# Altium project MioMicro.PrjPcb
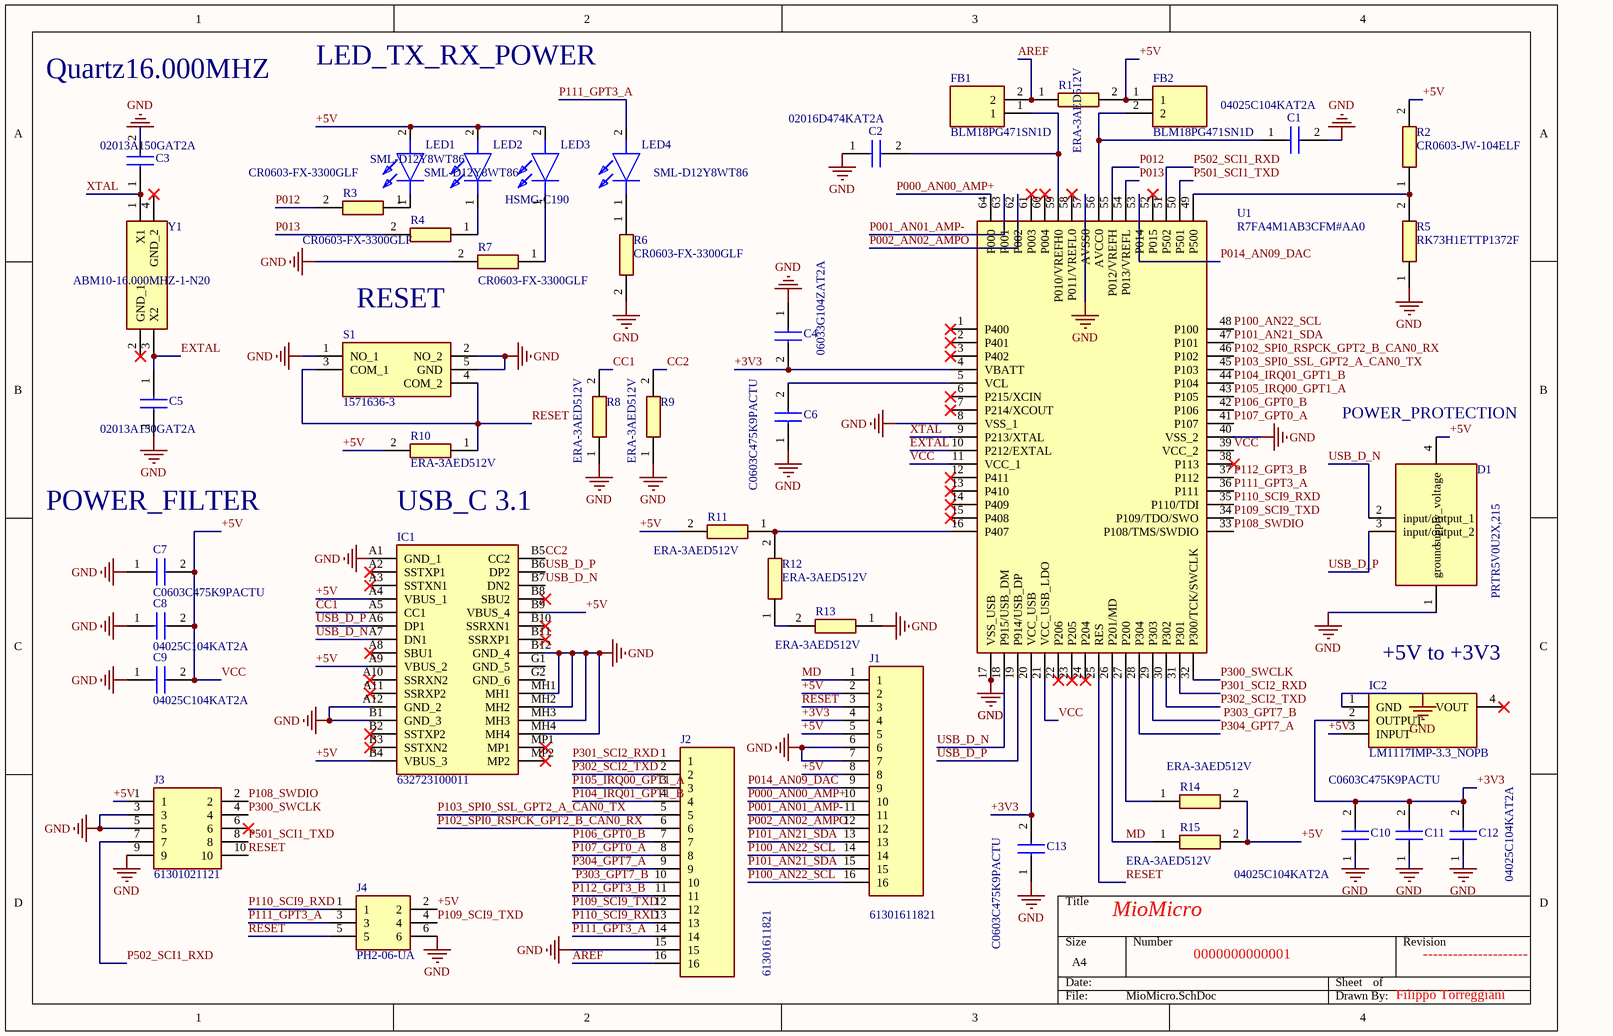
[diagram p0: MioMicro.SchDoc]
1 sheet, 44 parts. Net scope: global (net labels, ports and power ports of the same name join across sheets).
Board file: MioMicro.PcbDoc

## Sheet MioMicro.SchDoc
size A4; SheetNumber: 1; SheetTotal: 1

### Parts
C1  04025C104KAT2A  [CAPC1005X56N]
C2  02016D474KAT2A  [CAPC0603X33N]
C3  02013A150GAT2A  [CAPC0603X33N]
C4  06033G104ZAT2A  [CAPC1608X90N]
C5  02013A150GAT2A  [CAPC0603X33N]
C6  C0603C475K9PACTU  [C0603]
C7  C0603C475K9PACTU  [C0603]
C8  04025C104KAT2A  [CAPC1005X56N]
C9  04025C104KAT2A  [CAPC1005X56N]
C10  C0603C475K9PACTU  [C0603]
C11  04025C104KAT2A  [CAPC1005X56N]
C12  04025C104KAT2A  [CAPC1005X56N]
C13  C0603C475K9PACTU  [C0603]
D1  PRTR5V0U2X,215  [PRTR5V0U2X]
FB1  BLM18PG471SN1D  [BLM18SP221SN1B]
FB2  BLM18PG471SN1D  [BLM18SP221SN1B]
IC1  632723100011  [632723100011]
IC2  LM1117IMP-3.3_NOPB  [SOT230P700X180-4N]
J1  61301611821  [RHDR16W82P0X254_1X16_4114X250X865P]
J2  61301611821  [RHDR16W82P0X254_1X16_4114X250X865P]
J3  61301021121  [HDRV10W64P254X254_2X5_1270X508X869P]
J4  PH2-06-UA  [HDRV6W64P254_2X3_762X500X901P]
LED1  SML-D12Y8WT86  [LEDM1620X150N]
LED2  SML-D12Y8WT86  [LEDM1620X150N]
LED3  HSMG-C190  [LEDC1608X90N]
LED4  SML-D12Y8WT86  [LEDM1620X150N]
R1  ERA-3AED512V  [ERA3AEB101V]
R2  CR0603-JW-104ELF  [RESC1608X55N]
R3  CR0603-FX-3300GLF  [RESC1608X55N]
R4  CR0603-FX-3300GLF  [RESC1608X55N]
R5  RK73H1ETTP1372F  [RESC1005X40N]
R6  CR0603-FX-3300GLF  [RESC1608X55N]
R7  CR0603-FX-3300GLF  [RESC1608X55N]
R8  ERA-3AED512V  [ERA3AEB101V]
R9  ERA-3AED512V  [ERA3AEB101V]
R10  ERA-3AED512V  [ERA3AEB101V]
R11  ERA-3AED512V  [ERA3AEB101V]
R12  ERA-3AED512V  [ERA3AEB101V]
R13  ERA-3AED512V  [ERA3AEB101V]
R14  ERA-3AED512V  [ERA3AEB101V]
R15  ERA-3AED512V  [ERA3AEB101V]
S1  1571636-3  [15716363]
U1  R7FA4M1AB3CFM#AA0  [QFP50P1200X1200X170-64N]
Y1  ABM10-16.000MHZ-1-N20  [ABM10]

### Nets
GND: C1.2 C2.1 C3.2 C4.1 C5.2 C6.1 C7.1 C8.1 C9.1 C10.1 C11.1 C12.1 C13.1 D1.1(ground) IC1.A1(GND_1) IC1.A12(GND_2) IC1.B1(GND_3) IC1.B12(GND_4) IC1.MH1 IC1.MH2 IC1.MH3 IC1.MH4 IC2.1(GND) J1.6 J1.7 J2.15 J3.3 J3.5 J3.9 J4.6 R5.1 R6.2 R7.2 R8.1 R9.1 R13.1 S1.1(NO_1) S1.2(NO_2) S1.5(GND) U1.8(VSS_1) U1.17(VSS_USB) U1.40(VSS_2) U1.57(AVSS0)
 P303_GPT7_B: J2.10 U1.29(P303)
+3V3: C4.2 C10.2 C11.2 C12.2 C13.2 IC2.2(OUTPUT) J1.4 U1.4(VBATT) U1.20(VCC_USB)
+5V: C7.2 C8.2 C9.2 D1.4(supply_voltage) FB2.1 IC1.A4(VBUS_1) IC1.A9(VBUS_2) IC1.B4(VBUS_3) IC1.B9(VBUS_4) IC2.3(INPUT) J1.2 J1.5 J1.8 J3.1 J4.2 LED1.2(A) LED2.2(A) LED3.2(A) R1.2 R2.2 R10.2 R11.2 R14.2 R15.2 U1.11(VCC_1) U1.21(VCC_USB_LDO) U1.39(VCC_2)  [also labelled VCC]
AREF: FB1.2 J2.16 R1.1
CC1: IC1.A5(CC1) R8.2
CC2: IC1.B5(CC2) R9.2
EXTAL: C5.1 U1.10(P212/EXTAL) Y1.3(X2)
MD: J1.1 R15.1 U1.26(P201/MD)
P000_AN00_AMP+: J1.10 U1.64(P000)
P001_AN01_AMP-: J1.11 U1.63(P001)
P002_AN02_AMPO: J1.12 U1.62(P002)
P012: R3.2 U1.55(P012/VREFH)
P013: R4.2 U1.54(P013/VREFL)
P014_AN09_DAC: J1.9 U1.53(P014)
P100_AN22_SCL: J1.14 J1.16 U1.48(P100)
P101_AN21_SDA: J1.13 J1.15 U1.47(P101)
P102_SPI0_RSPCK_GPT2_B_CAN0_RX: J2.6 U1.46(P102)
P103_SPI0_SSL_GPT2_A_CAN0_TX: J2.5 U1.45(P103)
P104_IRQ01_GPT1_B: J2.4 U1.44(P104)
P105_IRQ00_GPT1_A: J2.3 U1.43(P105)
P106_GPT0_B: J2.7 U1.42(P106)
P107_GPT0_A: J2.8 U1.41(P107)
P108_SWDIO: J3.2 U1.33(P108/TMS/SWDIO)
P109_SCI9_TXD: J2.12 J4.4 U1.34(P109/TDO/SWO)
P110_SCI9_RXD: J2.13 J4.1 U1.35(P110/TDI)
P111_GPT3_A: J2.14 J4.3 LED4.2(A) U1.36(P111)
P112_GPT3_B: J2.11 U1.37(P112)
P300_SWCLK: J3.4 U1.32(P300/TCK/SWCLK)
P301_SCI2_RXD: J2.1 U1.31(P301)
P302_SCI2_TXD: J2.2 U1.30(P302)
P304_GPT7_A: J2.9 U1.28(P304)
P501_SCI1_TXD: J3.8 U1.50(P501)
P502_SCI1_RXD: J3.7 U1.51(P502)
RESET: J1.3 J3.10 J4.5 R10.1 S1.3(COM_1) S1.4(COM_2) U1.25(RES)
USB_D_N: D1.2(input/output_1) IC1.A7(DN1) IC1.B7(DN2) U1.18(P915/USB_DM)
USB_D_P: D1.3(input/output_2) IC1.A6(DP1) IC1.B6(DP2) U1.19(P914/USB_DP)
XTAL: C3.1 U1.9(P213/XTAL) Y1.1(X1)
NetC1_1: C1.1 FB2.2 U1.56(AVCC0)
NetC2_2: C2.2 FB1.1 U1.59(P010/VREFH0)
NetC6_2: C6.2 U1.5(VCL)
NetLED1_1: LED1.1(K) R3.1
NetLED2_1: LED2.1(K) R4.1
NetLED3_1: LED3.1(K) R7.1
NetLED4_1: LED4.1(K) R6.1
NetR2_1: R2.1 R5.2 U1.49(P500)
NetR11_1: R11.1 R12.2 U1.16(P407)
NetR12_1: R12.1 R13.2
NetR14_1: R14.1 U1.27(P200)

Not connected (* = marked no-connect by the designer): IC1 A2(SSTXP1)* A3(SSTXN1)* A8(SBU1)* A10(SSRXN2)* A11(SSRXP2)* B2(SSTXP2)* B3(SSTXN2)* B8(SBU2)* B10(SSRXN1)* B11(SSRXP1)* G1(GND_5) G2(GND_6) MP1* MP2*; IC2 4(VOUT)*; J3 6*; U1 1(P400)* 2(P401)* 3(P402)* 6(P215/XCIN)* 7(P214/XCOUT)* 12(P411)* 13(P410)* 14(P409)* 15(P408)* 22(P206)* 23(P205)* 24(P204)* 38(P113)* 52(P015)* 58(P011/VREFL0)* 60(P004)* 61(P003)*; Y1 2(GND_1)* 4(GND_2)*

### Notes on the sheet
- Quartz16.000MHZ
- LED_TX_RX_POWER
- RESET
- (near D1) POWER_PROTECTION
- POWER_FILTER
- USB_C 3.1
- +5V to +3V3
- MioMicro
- 0000000000001
- ---------------------
- Filippo Torreggiani

### Library data of the parts
C1 C8 C9 C11 C12 = 04025C104KAT2A: Capacitor; Manufacturer_Name: AVX; Datasheet Link: http://www.mouser.com/catalog/supplier/library/pdf/AVXSurfaceMountCeramic.pdf; Height: 0.56mm; Manufacturer_Part_Number: 04025C104KAT2A; Mouser Part Number: 581-04025C104KAT2A; Mouser Price/Stock: https://www.mouser.co.uk/ProductDetail/AVX/04025C104KAT2A?qs=ZBeOGGPQgEFYcwOskjAIVQ%3D%3D; Arrow Part Number: 04025C104KAT2A; Arrow Price/Stock: https://www.arrow.com/en/products/04025c104kat2a/avx?region=nac
C2 = 02016D474KAT2A: Capacitor; Manufacturer_Name: AVX; Datasheet Link: http://www.mouser.com/catalog/supplier/library/pdf/AVXSurfaceMountCeramic.pdf; Height: 0.33mm; Manufacturer_Part_Number: 02016D474KAT2A; Mouser Part Number: 581-02016D474KAT2A; Mouser Price/Stock: https://www.mouser.co.uk/ProductDetail/AVX/02016D474KAT2A?qs=a6Vv43ErYnwNI9YcsWUNpw%3D%3D
C3 C5 = 02013A150GAT2A: Capacitor; Manufacturer_Name: AVX; Datasheet Link: http://www.mouser.com/catalog/supplier/library/pdf/AVXSurfaceMountCeramic.pdf; Height: 0.33mm; Manufacturer_Part_Number: 02013A150GAT2A; Mouser Part Number: 581-02013A150GAT2A; Mouser Price/Stock: https://www.mouser.co.uk/ProductDetail/AVX/02013A150GAT2A/?qs=o212fjDx7AHn1RFYvVFd2g%3D%3D; Arrow Part Number: 02013A150GAT2A; Arrow Price/Stock: https://www.arrow.com/en/products/02013a150gat2a/avx
C4 = 06033G104ZAT2A: Capacitor; Manufacturer_Name: AVX; Datasheet Link: https://componentsearchengine.com/Datasheets/1/06031A100FAT2A.pdf; Height: 0.9mm; Manufacturer_Part_Number: 06033G104ZAT2A; Mouser Part Number: 581-06033G104Z; Mouser Price/Stock: https://www.mouser.co.uk/ProductDetail/AVX/06033G104ZAT2A?qs=NXubJDmysXJMPmHfVo6Z%252BA%3D%3D; Arrow Part Number: 06033G104ZAT2A; Arrow Price/Stock: https://www.arrow.com/en/products/06033g104zat2a/avx?region=nac
C6 C7 C10 C13 = C0603C475K9PACTU: Capacitor; Manufacturer_Name: KEMET; Datasheet Link: https://content.kemet.com/datasheets/KEM_C1006_X5R_SMD.pdf; Height: 0.87mm; Manufacturer_Part_Number: C0603C475K9PACTU; Mouser Part Number: 80-C0603C475K9P; Mouser Price/Stock: https://www.mouser.co.uk/ProductDetail/KEMET/C0603C475K9PACTU?qs=UdQET6xYxVBhr%252BaRHVEWxA%3D%3D; Arrow Part Number: C0603C475K9PACTU; Arrow Price/Stock: https://www.arrow.com/en/products/c0603c475k9pactu/kemet-corporation?region=nac
D1 = PRTR5V0U2X,215: Diode; Manufacturer_Name: Nexperia; Datasheet Link: https://assets.nexperia.com/documents/data-sheet/PRTR5V0U2X.pdf; Height: 1.1mm; Manufacturer_Part_Number: PRTR5V0U2X,215; Mouser Part Number: 771-PRTR5V0U2X-T/R; Mouser Price/Stock: https://www.mouser.co.uk/ProductDetail/Nexperia/PRTR5V0U2X215?qs=LOCUfHb8d9sDkgY4cRj8Lw%3D%3D; Arrow Part Number: PRTR5V0U2X,215; Arrow Price/Stock: https://www.arrow.com/en/products/prtr5v0u2x215/nexperia?region=europe
FB1 FB2 = BLM18PG471SN1D: Ferrite Bead; Manufacturer_Name: Murata Electronics; Datasheet Link: http://www.murata.com/~/media/webrenewal/support/library/catalog/products/emc/emifil/c31e.ashx?la=en-gb; Height: 0.95mm; Manufacturer_Part_Number: BLM18PG471SN1D; Mouser Part Number: 81-BLM18PG471SN1D; Mouser Price/Stock: https://www.mouser.co.uk/ProductDetail/Murata-Electronics/BLM18PG471SN1D?qs=EYzdjubb4S%2FN1Ip39GrHyg%3D%3D; Arrow Part Number: BLM18PG471SN1D; Arrow Price/Stock: https://www.arrow.com/en/products/blm18pg471sn1d/murata-manufacturing?region=nac
IC1 = 632723100011: Integrated Circuit; Manufacturer_Name: Wurth Elektronik; Datasheet Link: https://componentsearchengine.com/Datasheets/1/632723100011.pdf; Height: 3.11mm; Manufacturer_Part_Number: 632723100011; Mouser Part Number: 710-632723100011; Mouser Price/Stock: https://www.mouser.co.uk/ProductDetail/Wurth-Elektronik/632723100011?qs=NK6InXoXhq4o62C9ULXLjQ%3D%3D
IC2 = LM1117IMP-3.3_NOPB: Integrated Circuit; Manufacturer_Name: Texas Instruments; Manufacturer_Part_Number: LM1117IMP-3.3/NOPB; Datasheet Link: https://www.ti.com/lit/ds/symlink/lm1117.pdf?ts=1607578196475&ref_url=https%253A%252F%252Fwww.google.com%252F; Height: 1.8mm; Mouser Part Number: 926-LM1117IMP3.3NOPB; Mouser Price/Stock: https://www.mouser.co.uk/ProductDetail/Texas-Instruments/LM1117IMP-3.3-NOPB?qs=X1J7HmVL2ZFbpN1TgOsjYQ%3D%3D; Arrow Part Number: LM1117IMP-3.3/NOPB; Arrow Price/Stock: https://www.arrow.com/en/products/lm1117imp-3.3nopb/texas-instruments?region=nac
J1 J2 = 61301611821: Connector; Manufacturer_Name: Wurth Elektronik; Datasheet Link: https://www.we-online.com/catalog/datasheet/61301611821.pdf; Height: 8.65mm; Manufacturer_Part_Number: 61301611821; Mouser Part Number: 710-61301611821; Mouser Price/Stock: https://www.mouser.co.uk/ProductDetail/Wurth-Elektronik/61301611821?qs=xZ%2FP%252Ba9zWqYIxo6RU%252B1Wuw%3D%3D
J3 = 61301021121: Connector; Manufacturer_Name: Wurth Elektronik; Datasheet Link: https://www.mouser.com/datasheet/2/445/61301021121-1717849.pdf; Height: 8.69mm; Manufacturer_Part_Number: 61301021121; Mouser Part Number: 710-61301021121; Mouser Price/Stock: https://www.mouser.co.uk/ProductDetail/Wurth-Elektronik/61301021121?qs=ZtY9WdtwX5612K9FdDCZCA%3D%3D
J4 = PH2-06-UA: Connector; Manufacturer_Name: Adam Tech; Datasheet Link: https://datasheet.datasheetarchive.com/originals/distributors/Datasheets_SAMA/c63e3fe101e7b6e3957e7ad4a1a98367.pdf; Height: 9.008mm; Manufacturer_Part_Number: PH2-06-UA; Arrow Part Number: PH2-06-UA; Arrow Price/Stock: https://www.arrow.com/en/products/ph2-06-ua/adam-tech?region=nac
LED1 LED2 LED4 = SML-D12Y8WT86: LED; Manufacturer_Name: ROHM Semiconductor; Datasheet Link: https://datasheet.datasheetarchive.com/originals/distributors/Datasheets_SAMA/f235664866caa647598714bb71411137.pdf; Height: 1.5mm; Manufacturer_Part_Number: SML-D12Y8WT86; Mouser Part Number: 755-SML-D12Y8WT86; Mouser Price/Stock: https://www.mouser.co.uk/ProductDetail/ROHM-Semiconductor/SML-D12Y8WT86?qs=4kLU8WoGk0uSsIIn7EVV1A%3D%3D; Arrow Part Number: SML-D12Y8WT86; Arrow Price/Stock: https://www.arrow.com/en/products/sml-d12y8wt86/rohm-semiconductor
LED3 = HSMG-C190: LED; Manufacturer_Name: Avago Technologies; Datasheet Link: https://docs.broadcom.com/docs/AV02-0551EN; Height: 0.9mm; Manufacturer_Part_Number: HSMG-C190; Mouser Part Number: 630-HSMG-C190; Mouser Price/Stock: https://www.mouser.co.uk/ProductDetail/Broadcom-Avago/HSMG-C190?qs=YDL0qNrpDT605sxOaps8VQ%3D%3D
R1 R8-R15 = ERA-3AED512V: Resistor; Manufacturer_Name: Panasonic; Datasheet Link: https://industrial.panasonic.com/cdbs/www-data/pdf/RDM0000/AOA0000C307.pdf; Height: 0.55mm; Manufacturer_Part_Number: ERA-3AED512V; Mouser Part Number: 667-ERA-3AED512V; Mouser Price/Stock: https://www.mouser.co.uk/ProductDetail/Panasonic/ERA-3AED512V?qs=SWVmE3OSrOnwfhRAKpyP%252Bg%3D%3D; Arrow Part Number: ERA-3AED512V; Arrow Price/Stock: https://www.arrow.com/en/products/era3aed512v/panasonic?region=nac
R2 = CR0603-JW-104ELF: Resistor; Manufacturer_Name: Bourns; Datasheet Link: https://www.bourns.com/pdfs/chpreztr.pdf; Height: 0.55mm; Manufacturer_Part_Number: CR0603-JW-104ELF; Mouser Part Number: 652-CR0603-JW-104ELF; Mouser Price/Stock: https://www.mouser.co.uk/ProductDetail/Bourns/CR0603-JW-104ELF?qs=wOX%252BDVkMoZSK2gq9cFrtRg%3D%3D; Arrow Part Number: CR0603-JW-104ELF; Arrow Price/Stock: https://www.arrow.com/en/products/cr0603-jw-104elf/bourns?region=europe
R3 R4 R6 R7 = CR0603-FX-3300GLF: Resistor; Manufacturer_Name: Bourns; Datasheet Link: https://www.bourns.com/pdfs/chpreztr.pdf; Height: 0.55mm; Manufacturer_Part_Number: CR0603-FX-3300GLF; Mouser Part Number: 652-CR0603-FX3300GLF; Mouser Price/Stock: https://www.mouser.com/Search/Refine.aspx?Keyword=652-CR0603-FX3300GLF; Arrow Part Number: CR0603-FX-3300GLF; Arrow Price/Stock: https://www.arrow.com/en/products/cr0603-fx-3300glf/bourns
R5 = RK73H1ETTP1372F: Resistor; Manufacturer_Name: KOA Speer; Datasheet Link: http://www.koaspeer.com/catimages/Products/RK73-RT/RK73-RT.pdf; Height: 0.4mm; Manufacturer_Part_Number: RK73H1ETTP1372F; Mouser Part Number: 660-RK73H1ETTP1372F; Mouser Price/Stock: https://www.mouser.co.uk/ProductDetail/KOA-Speer/RK73H1ETTP1372F?qs=5lBKR3i2fIPHUeKlxjMAIA%3D%3D
S1 = 1571636-3: Switch; Manufacturer_Name: TE Connectivity; Datasheet Link: https://www.mouser.com/datasheet/2/418/NG_CD_1571636_C2-652439.pdf; Height: 2.5mm; Manufacturer_Part_Number: 1571636-3; Mouser Part Number: 506-1571636-3; Mouser Price/Stock: https://www.mouser.co.uk/ProductDetail/TE-Connectivity-Alcoswitch/1571636-3?qs=9qK3lZr%252Bi0Iiy0ZiPH8Cfg%3D%3D
U1 = R7FA4M1AB3CFM#AA0: Integrated Circuit; Manufacturer_Name: Renesas Electronics; Datasheet Link: https://www.renesas.com/document/dst/renesas-ra4m1-group-datasheet?language=en&r=1054146; Height: 1.7mm; Manufacturer_Part_Number: R7FA4M1AB3CFM#AA0; Mouser Part Number: 968-7FA4M1AB3CFM#AA0; Mouser Price/Stock: https://www.mouser.co.uk/ProductDetail/Renesas-Electronics/R7FA4M1AB3CFMAA0?qs=d0WKAl%252BL4KbrKuAsyurXHw%3D%3D
Y1 = ABM10-16.000MHZ-1-N20: Crystal or Oscillator; Manufacturer_Name: ABRACON; Datasheet Link: https://abracon.com/Resonators/ABM10.pdf; Height: 0.7mm; Manufacturer_Part_Number: ABM10-16.000MHZ-1-N20